# EAGLE design bancada_pitot (EAGLE 9.0.0)
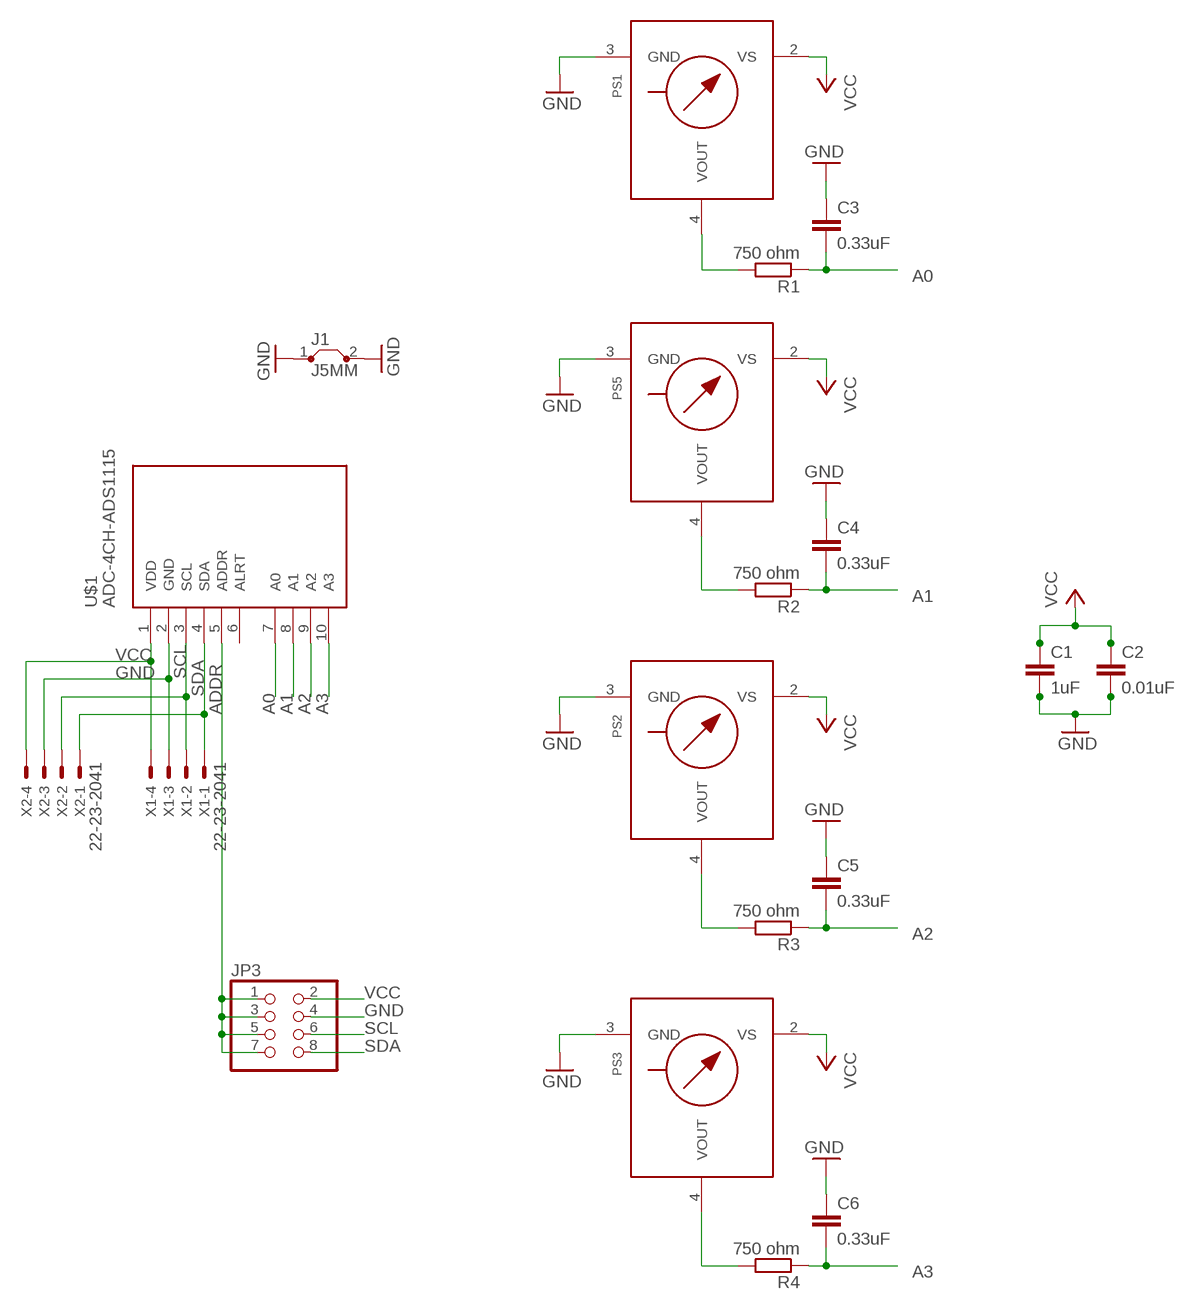
[diagram p0: schematic, sheet 1]

## Parts
C1  1uF  C-EU025-025X050  [C025-025X050]
C2  0.01uF  C-EU025-025X050  [C025-025X050]
C3  0.33uF  C-EU025-025X050  [C025-025X050]
C4  0.33uF  C-EU025-025X050  [C025-025X050]
C5  0.33uF  C-EU025-025X050  [C025-025X050]
C6  0.33uF  C-EU025-025X050  [C025-025X050]
J1  J5MM  [05]
JP3  PINHD-2X4  [2X04]
PS1  MPX-1351  [1351]
PS2  MPX-1351  [1351]
PS3  MPX-1351  [1351]
PS5  MPX-1351  [1351]
R1  750 ohm  R-EU_0207/2V  [0207/2V]
R2  750 ohm  R-EU_0207/2V  [0207/2V]
R3  750 ohm  R-EU_0207/2V  [0207/2V]
R4  750 ohm  R-EU_0207/2V  [0207/2V]
U$1  ADC-4CH-ADS1115  [ADC-4CH-ADS1115]
X1  22-23-2041  [22-23-2041]
X2  22-23-2041  [22-23-2041]

## Nets
A0: C3.2 R1.1 U$1.7(A0)
A1: C4.2 R2.1 U$1.8(A1)
A2: C5.2 R3.1 U$1.9(A2)
A3: C6.2 R4.1 U$1.10(A3)
ADDR: JP3.1 JP3.3 JP3.5 JP3.7 U$1.5(ADDR)
GND: C1.2 C2.2 C3.1 C4.1 C5.1 C6.1 J1.1 J1.2 JP3.4 PS1.3(GND) PS2.3(GND) PS3.3(GND) PS5.3(GND) U$1.2(GND) X1.3 X2.3
N$21: PS1.4(VOUT) R1.2
N$22: PS5.4(VOUT) R2.2
N$23: PS2.4(VOUT) R3.2
N$24: PS3.4(VOUT) R4.2
SCL: JP3.6 U$1.3(SCL) X1.2 X2.2
SDA: JP3.8 U$1.4(SDA) X1.1 X2.1
VCC: C1.1 C2.1 JP3.2 PS1.2(VS) PS2.2(VS) PS3.2(VS) PS5.2(VS) U$1.1(VDD) X1.4 X2.4
Unconnected: PS1.1(NC) PS1.5(NC) PS1.6(NC) PS2.1(NC) PS2.5(NC) PS2.6(NC) PS3.1(NC) PS3.5(NC) PS3.6(NC) PS5.1(NC) PS5.5(NC) PS5.6(NC) U$1.6(ALRT)

## Library data of the parts
C1-C6 = resistor:C-EU: CAPACITOR, European symbol
J1 = jumper:J: Bridge
JP3 = pinhead:PINHD-2X4: PIN HEADER
PS1-PS3 PS5 = mpx-freescale:MPX*****: Generic MPX pressure sensor
R1-R4 = rcl:R-EU_: RESISTOR, European symbol; SPICEPREFIX: R
U$1 = diy_modules:ADC-4CH-ADS1115: 4 Channel 16-Bit Analog-to-Digital Converter based on ADS1115 chip Arduino ADS1115 Getting Started Tutorial is available here: http://henrysbench.capnfatz.com/henrys-bench/arduino-voltage-measurements/arduino-ads1115-module-getting-started-tutorial/ ADS1115 datasheet is available here: http://www.ti.com/lit/ds/symlink/ads1115.pdf Click here to find device on ebay.com <http://www.ebay.com/sch/ads1115+module>
X1 X2 = con-molex:22-23-2041: .100" (2.54mm) Center Header - 4 Pin; MF: MOLEX; MPN: 22-23-2041; OC_FARNELL: 1462920; OC_NEWARK: 38C0355

## Net classes
0 default: clearance 0.205 mm

## Board
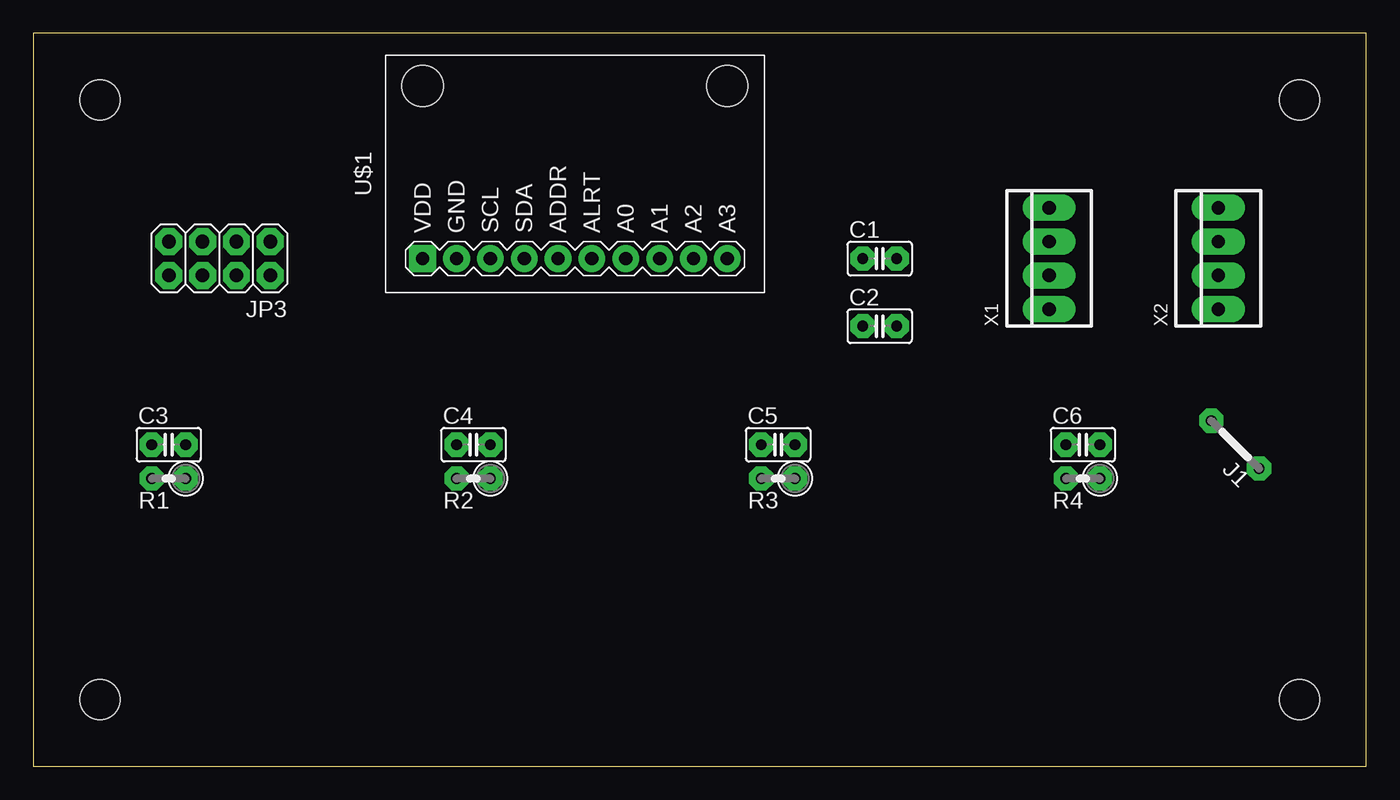
[diagram p1: board, top side]
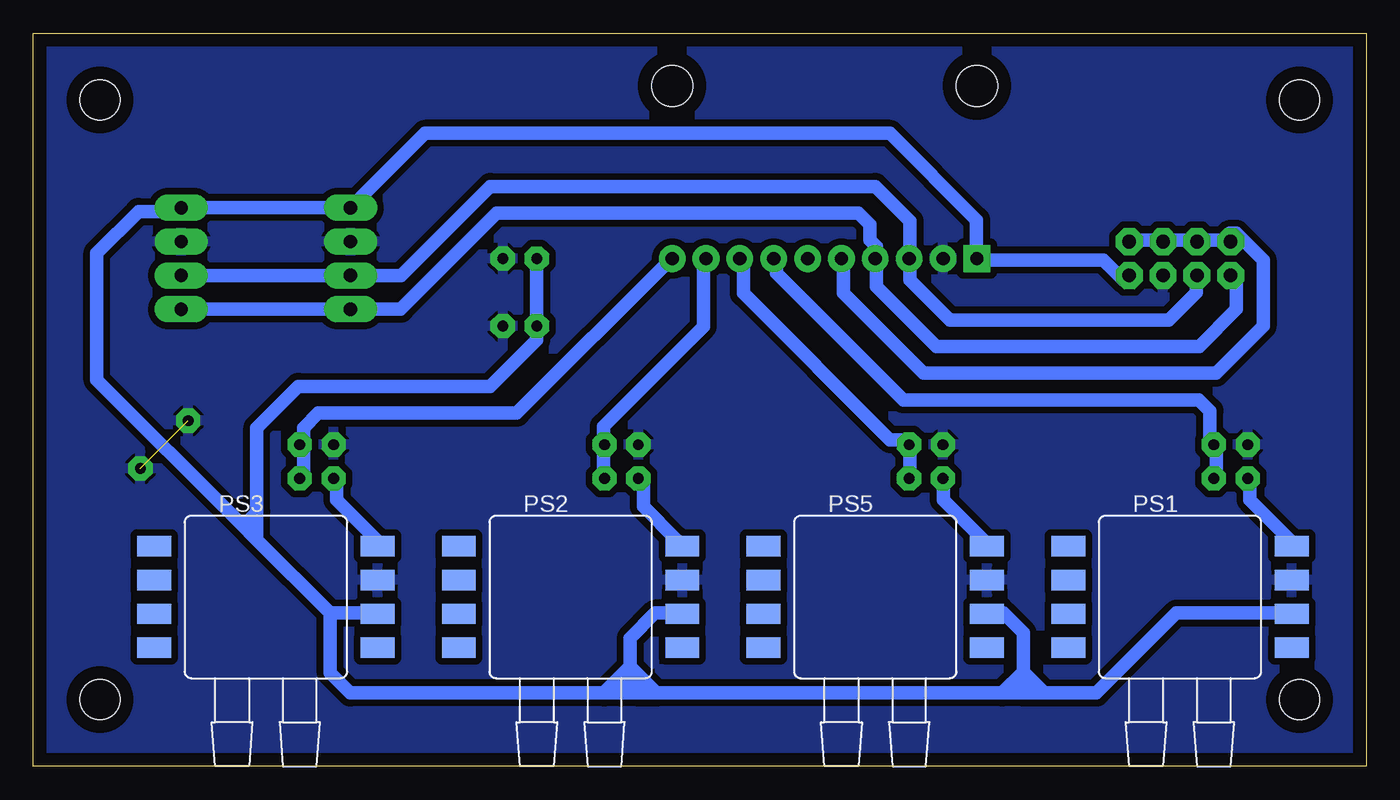
[diagram p2: board, bottom side, seen from below]

Size 100 x 55 mm. Coordinates in mm from the lower left corner, seen from the top.
Outline: 0,0 100,0 100,55 0,55 0,0
Copper layers (1*16): Top 0.035mm / dielectric 1.5mm / Bottom 0.035mm
Design rules "drc_inep": minimum track width 20mil, minimum drill 0.2mm, track to track 20mil, track to pad 20mil, pad to pad 20mil, via to via 20mil, smd to smd 20mil, copper to edge 1mm, drill to drill 1.5mm, minimum pad ring 0.5mm, minimum via ring 0.5mm, stop-mask expansion 4mil, vias tented up to drill 0mil, thermal gap 10mil
Holes 3 mm at 5,50 5,5 95,50 95,5

### Footprints (pad centres in the part's own frame; a part is rotated, then mirrored left to right if it is on the bottom)
C025-025X050 = drill 0.813 octagon: 1 -1.27,0; 2 1.27,0
05 = drill 0.813 pad 1.6 octagon: 1 -2.54,0; 2 2.54,0
2X04 = drill 1.016 octagon: 1 -3.81,-1.27; 2 -3.81,1.27; 3 -1.27,-1.27; 4 -1.27,1.27; 5 1.27,-1.27; 6 1.27,1.27; 7 3.81,-1.27; 8 3.81,1.27
1351 = smd 2.54 x 1.524: 1 8.382,-3.81; 2 8.382,-1.27; 3 8.382,1.27; 4 8.382,3.81; 5 -8.382,3.81; 6 -8.382,1.27; 7 -8.382,-1.27; 8 -8.382,-3.81
0207/2V = drill 0.813 octagon: 1 -1.27,0; 2 1.27,0
ADC-4CH-ADS1115 = drill 1 square: 1 -6.35,11.43 | drill 1: 2 -6.35,8.89; 3 -6.35,6.35; 4 -6.35,3.81; 5 -6.35,1.27; 6 -6.35,-1.27; 7 -6.35,-3.81; 8 -6.35,-6.35; 9 -6.35,-8.89; 10 -6.35,-11.43 | hole 3.1: 6.604,11.43; 6.604,-11.43
22-23-2041 = drill 1 long: 1 -3.81,0; 2 -1.27,0; 3 1.27,0; 4 3.81,0

### Placement (x,y rotation side)
C1  63.5,38.1 0 top
C2  63.5,33.02 0 top
C3  10.16,24.13 0 top
C4  33.02,24.13 0 top
C5  55.88,24.13 0 top
C6  78.74,24.13 0 top
J1  90.17,24.13 135 top
JP3  13.97,38.1 180 top
PS1  13.97,12.7 0 bottom
PS2  59.69,12.7 0 bottom
PS3  82.55,12.7 0 bottom
PS5  36.83,12.7 0 bottom
R1  10.16,21.59 180 top
R2  33.02,21.59 180 top
R3  55.88,21.59 180 top
R4  78.74,21.59 180 top
U$1  40.64,44.45 90 top
X1  76.2,38.1 90 top
X2  88.9,38.1 90 top

### Tracks (layer width: path | path; a pad name or v marks a point on that pad's centre or on a via)
A0
  Bottom 1: R1.1 11.23,22 11.23,24 C3.2 11.73,24.5 11.73,26.67 12.56,27.5 34.73,27.5 44.23,37 44.23,38 U$1.7
A1
  Bottom 1: R2.1 34.23,22 34.23,24 C4.2 34.73,24.5 35.73,24.5 46.73,35.5 46.73,38 U$1.8
A2
  Bottom 1: R3.1 57.23,22 57.23,24 C5.2 57.23,24.5 57.23,25.5 49.73,33 49.73,38 U$1.9
A3
  Bottom 1: R4.1 79.73,22 79.73,24 C6.2 79.73,24.5 79.73,25.4 78.63,26.5 63.73,26.5 52.23,38 U$1.10
ADDR
  Bottom 1: JP3.1 17.73,39.5 15.73,39.5 JP3.3 15.23,39.5 12.73,39.5 JP3.5 12.23,39.5 10.73,39.5 JP3.7 10.23,39.5 10.23,40 9.73,40 7.73,38 7.73,33.02 11.25,29.5 33.23,29.5 39.23,35.5 39.23,38 U$1.5
GND  (1 unrouted)
  pour Bottom: -3.81,55.88 101.6,55.88 101.6,-2.54 -3.81,-2.54
N$21
  Bottom 1: PS1.4 5.73,17 8.73,20 8.73,21.5 R1.2
N$22
  Bottom 1: PS5.4 28.73,17 31.73,20 31.73,21.5 R2.2
N$23
  Bottom 1: PS2.4 51.73,17 54.23,19.5 54.23,21.5 R3.2
N$24
  Bottom 1: PS3.4 74.23,17 77.23,20 77.23,21.5 R4.2
SCL
  Bottom 1: JP3.6 12.73,36.5 12.73,35.56 14.79,33.5 31.23,33.5 34.23,36.5 34.23,38 U$1.3 34.23,38.5 34.23,40.9 36.83,43.5 65.73,43.5 72.4,36.83 X1.2 X2.2
SDA
  Bottom 1: JP3.8 9.73,36.5 9.73,34.29 12.52,31.5 32.23,31.5 36.73,36 36.73,38 U$1.4 36.73,38.5 36.73,39 37.23,39.5 37.23,40.64 38.09,41.5 65.23,41.5 72.44,34.29 X1.1 X2.1
VCC
  Bottom 1: JP3.2 18.23,36.5 19.73,38 28.73,38 U$1.1 29.23,38.5 29.23,41 35.73,47.5 70.61,47.5 X1.4 X2.4 90.45,41.63 92.11,41.63 95.23,38.51 95.23,29 84.55,18.32 | C1.1 C2.1 62.23,32 65.73,28.5 80.13,28.5 83.23,25.4 83.23,19.05 | 25.73,5.5 24.13,5.5 | 24.13,5.5 20.23,5.5 14.23,11.5 5.73,11.5 PS1.2 | 25.73,7.1 25.73,10 27.23,11.5 28.23,11.5 PS5.2 | 25.73,7.1 25.73,5.5 | 53.23,5.5 53.48,5.75 | 53.48,5.75 54.98,7.25 | 54.98,7.25 55.23,7.5 | 25.73,5.5 27.33,5.5 | 27.33,5.5 53.23,5.5 | PS2.2 51.73,11.5 53.34,11.5 55.23,9.61 55.23,7.5 | 77.73,11.5 74.23,11.5 PS3.2 | 77.73,11.5 77.73,7 76.23,5.5 57.15,5.5 | 53.73,5.5 54.61,5.5 | 54.61,5.5 55.88,5.5 | 55.88,5.5 57.15,5.5 | 53.73,5.5 53.48,5.75 | 83.23,17 83.23,19.05 | 77.73,11.5 83.23,17 | 24.13,5.5 25.73,7.1 | 25.73,7.1 27.33,5.5 | 55.23,7.5 57.15,5.58 57.15,5.5 | 54.98,7.25 54.98,6.4 | 54.98,6.4 55.88,5.5 | 54.61,5.5 54.61,6.03 54.98,6.4 | 53.73,5.5 53.23,5.5 | 83.23,17 84.55,18.32 | 83.23,19.05 83.96,18.32 84.55,18.32